# Altium schematic sheet MCP2551.SchDoc
size A4
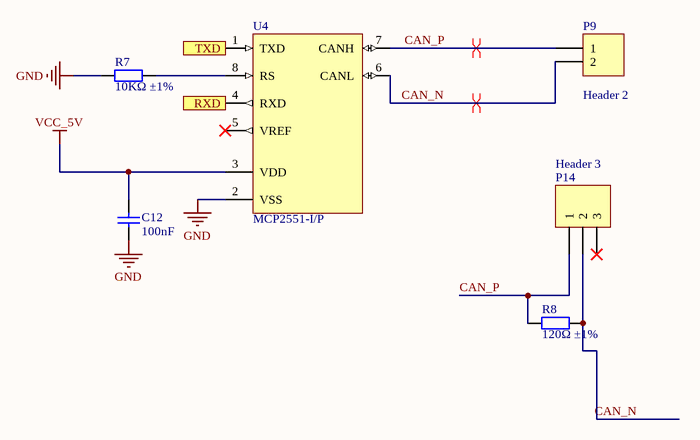
[diagram p0: MCP2551.SchDoc]

## Parts
C12  100nF  [0603_C]
P9  Header 2  [HDR1X2]
P14  Header 3  [HDR1X3]
R7  10KΩ ±1%  [0805_R]
R8  120Ω ±1%  [0603_R]
U4  MCP2551-I/P  [PDIP300-P8]

## Ports
RXD, TXD

## Nets
GND: C12.1 R7.2 U4.2(VSS)
VCC_5V: C12.2 U4.3(VDD)
CAN_N: P9.2 P14.2 R8.1 U4.6(CANL)
CAN_P: P9.1 P14.1 R8.2 U4.7(CANH)
RXD: U4.4(RXD) ; port RXD
TXD: U4.1(TXD) ; port TXD
NetR7_1: R7.1 U4.8(RS)

Not connected (* = marked no-connect by the designer): P14 3*; U4 5(VREF)*

## Layout directives
differential pair: CAN_N, CAN_P

## Library data of the parts
C12 = 0603 100nF (104) 10% 50V: Chip capacitors; Manufacturer: YAGEO; PartNumber: CC0603KRX7R9BB104; Tolerance: 10%; Voltage: 50V; ComponentLink1Description: Supplier link; ComponentLink1URL: http://www.szlcsc.com/product/details_15331.html; Package: 0603; Supplier: LC; SuppliersPartNumber: C14663; Capacitance: 100nF
P9 = Header 2: Header, 2-Pin; LatestRevisionDate: 17-Jul-2002; LatestRevisionNote: Re-released for DXP Platform.; Publisher: Altium Limited
P14 = Header 3: Header, 3-Pin; LatestRevisionDate: 17-Jul-2002; LatestRevisionNote: Re-released for DXP Platform.; Publisher: Altium Limited
R7 = 0805 10K (1002) 1%: Chip resistor; Manufacturer: Uniroyal Elec; PartNumber: 0805W8F1002T5E; Power: 1/8W; ComponentLink1Description: Supplier link; ComponentLink1URL: http://www.szlcsc.com/product/details_18102.html; Package: 0805; Supplier: LC; SuppliersPartNumber: C17414; Resistance: 10KΩ; Tolerance: 1%
R8 = 0603 120R (1200) 1%: Chip resistor; Manufacturer: Uniroyal Elec; PartNumber: 0603WAF1200T5E; Power: 1/10W; ComponentLink1Description: Supplier link; ComponentLink1URL: http://www.szlcsc.com/product/details_23514.html; Package: 0603; Supplier: LC; SuppliersPartNumber: C22787; Resistance: 120Ω; Tolerance: 1%
U4 = CMP-0186-00101-2: High-Speed CAN Transceiver, 8-Pin PDIP, Industrial Temperature; PackageDescription: 8-Lead Plastic Dual In-Line (P) - 300 mil Body [PDIP]; Code_JEDEC: MS-001; ComponentLink1Description: Manufacturer URL; DatasheetVersion: revF, Jul-2010; PackageReference: PDIP300-P8; ComponentLink3Description: Package Specification; ComponentLink3URL: http://www.microchip.com/stellent/groups/techpub_sg/documents/packagingspec/en012702.pdf; ComponentLink2URL: http://ww1.microchip.com/downloads/en/DeviceDoc/21667F.pdf; ComponentLink1URL: http://www.microchip.com/; RevisionNote: URLs added. DatasheetVersion updated.; PackageVersion: revBB, Aug-2009; ComponentLink2Description: Datasheet